# EAGLE schematic pimc_pb (EAGLE 5.07)
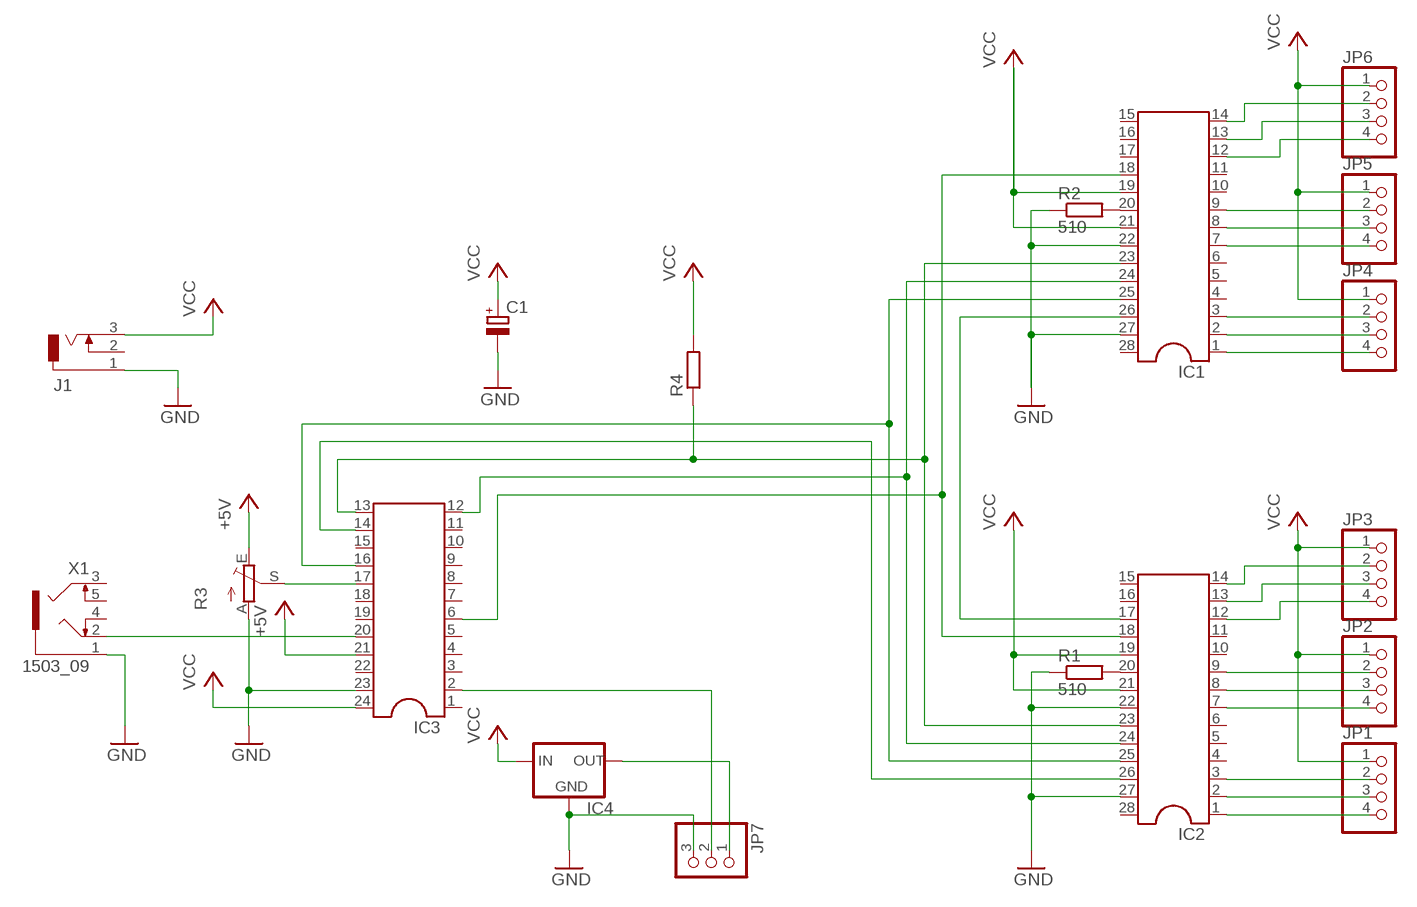
[diagram p0: schematic, sheet 1]

## Parts
C1  CPOL-EUE5-8.5  [E5-8,5]
IC1  DIL28-3  [DIL28-3]
IC2  DIL28-3  [DIL28-3]
IC3  DIL24-6  [DIL24-6]
IC4  78MXXS  [78MXXS]
J1  DCJ0303  [DCJ0303]
JP1  PINHD-1X4  [1X04]
JP2  PINHD-1X4  [1X04]
JP3  PINHD-1X4  [1X04]
JP4  PINHD-1X4  [1X04]
JP5  PINHD-1X4  [1X04]
JP6  PINHD-1X4  [1X04]
JP7  PINHD-1X3  [1X03]
R1  510  R-EU_0204/7  [0204/7]
R2  510  R-EU_0204/7  [0204/7]
R3  TRIM_EU-LI10  [LI10]
R4  R-EU_0204/7  [0204/7]
X1  1503_09  [1503_09]

## Nets
+5V: IC3.21 R3.E
GND: C1.- IC1.22 IC1.27 IC2.22 IC2.27 IC3.23 IC4.GND J1.1 JP7.3 R1.1 R2.1 R3.A X1.1
N$1: IC1.25 IC2.25 IC3.16
N$2: IC1.24 IC2.24 IC3.12
N$3: IC1.23 IC2.23 IC3.13 R4.1
N$4: IC1.26 IC2.17
N$5: IC2.26 IC3.14
N$6: IC1.18 IC2.18 IC3.6
N$7: IC2.20 R1.2
N$8: IC1.20 R2.2
N$9: IC2.1 JP1.4
N$10: IC2.2 JP1.3
N$11: IC2.3 JP1.2
N$12: IC2.7 JP2.4
N$13: IC2.8 JP2.3
N$14: IC2.9 JP2.2
N$15: IC2.12 JP3.4
N$16: IC2.13 JP3.3
N$17: IC2.14 JP3.2
N$18: IC1.1 JP4.4
N$19: IC1.2 JP4.3
N$20: IC1.3 JP4.2
N$21: IC1.7 JP5.4
N$22: IC1.8 JP5.3
N$23: IC1.9 JP5.2
N$24: IC1.14 JP6.2
N$25: IC1.13 JP6.3
N$26: IC1.12 JP6.4
N$29: IC3.2 JP7.2
N$30: IC4.OUT JP7.1
N$31: IC3.20 X1.2
N$34: IC3.17 R3.S
VCC: C1.+ IC1.19 IC1.21 IC2.19 IC2.21 IC3.24 IC4.IN J1.3 JP1.1 JP2.1 JP3.1 JP4.1 JP5.1 JP6.1 R4.2
Unconnected: IC1.4 IC1.5 IC1.6 IC1.10 IC1.11 IC1.15 IC1.16 IC1.17 IC1.28 IC2.4 IC2.5 IC2.6 IC2.10 IC2.11 IC2.15 IC2.16 IC2.28 IC3.1 IC3.3 IC3.4 IC3.5 IC3.7 IC3.8 IC3.9 IC3.10 IC3.11 IC3.15 IC3.18 IC3.19 IC3.22 J1.2 X1.3 X1.4 X1.5

## Library data of the parts
C1 = rcl:CPOL-EU: POLARIZED CAPACITOR, European symbol
IC1 IC2 = ic-package:DIL28: Dual In Line
IC3 = ic-package:DIL24: Dual In Line
IC4 = v-reg:78MXXS: VOLTAGE REGULATOR
J1 = con-jack:DCJ0303: DC POWER JACK Source: DCJ0303.pdf
JP1-JP6 = pinhead:PINHD-1X4: PIN HEADER
JP7 = pinhead:PINHD-1X3: PIN HEADER
R1 R2 R4 = rcl:R-EU_: RESISTOR, European symbol
R3 = pot:TRIM_EU-: POTENTIOMETER
X1 = con-lumberg:1503_09: Jack connectors according to JISC 6560, 3.5 mm Klinkeneinbaukupplung nach JISC 6560, 3,5 mm, 3-polig/ stereo, abgewinkelte Ausführung, mit 2 Öffnern und Lötaugen, für Leiterplatten Rückseitenmontage Source: http://www.lumberg.com/Produkte/PDFs/1503_09.pdf